# EAGLE design untitled (EAGLE 5.07)
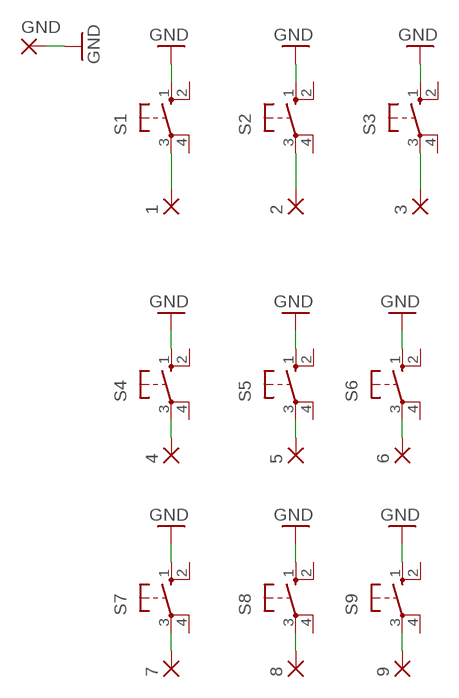
[diagram p0: schematic, sheet 1]

## Parts
1  2,15/1,0  [2,15/1,0]
2  2,15/1,0  [2,15/1,0]
3  2,15/1,0  [2,15/1,0]
4  2,15/1,0  [2,15/1,0]
5  2,15/1,0  [2,15/1,0]
6  2,15/1,0  [2,15/1,0]
7  2,15/1,0  [2,15/1,0]
8  2,15/1,0  [2,15/1,0]
9  2,15/1,0  [2,15/1,0]
GND  2,15/1,0  [2,15/1,0]
S1  10-XX  [B3F-10XX]
S2  10-XX  [B3F-10XX]
S3  10-XX  [B3F-10XX]
S4  10-XX  [B3F-10XX]
S5  10-XX  [B3F-10XX]
S6  10-XX  [B3F-10XX]
S7  10-XX  [B3F-10XX]
S8  10-XX  [B3F-10XX]
S9  10-XX  [B3F-10XX]

## Nets
GND: GND.1(P) S1.1(S) S2.1(S) S3.1(S) S4.1(S) S5.1(S) S6.1(S) S7.1(S) S8.1(S) S9.1(S)
N$1: 4.1(P) S4.3(P)
N$2: 5.1(P) S5.3(P)
N$3: 1.1(P) S1.3(P)
N$4: 2.1(P) S2.3(P)
N$5: 3.1(P) S3.3(P)
N$6: 6.1(P) S6.3(P)
N$7: 7.1(P) S7.3(P)
N$8: 8.1(P) S8.3(P)
N$9: 9.1(P) S9.3(P)
Unconnected: S1.2(S1) S1.4(P1) S2.2(S1) S2.4(P1) S3.2(S1) S3.4(P1) S4.2(S1) S4.4(P1) S5.2(S1) S5.4(P1) S6.2(S1) S6.4(P1) S7.2(S1) S7.4(P1) S8.2(S1) S8.4(P1) S9.2(S1) S9.4(P1)

## Library data of the parts
1-9 GND = wirepad:2,15/1,0: THROUGH-HOLE PAD
S1-S9 = switch-omron:10-XX: OMRON SWITCH

## Board
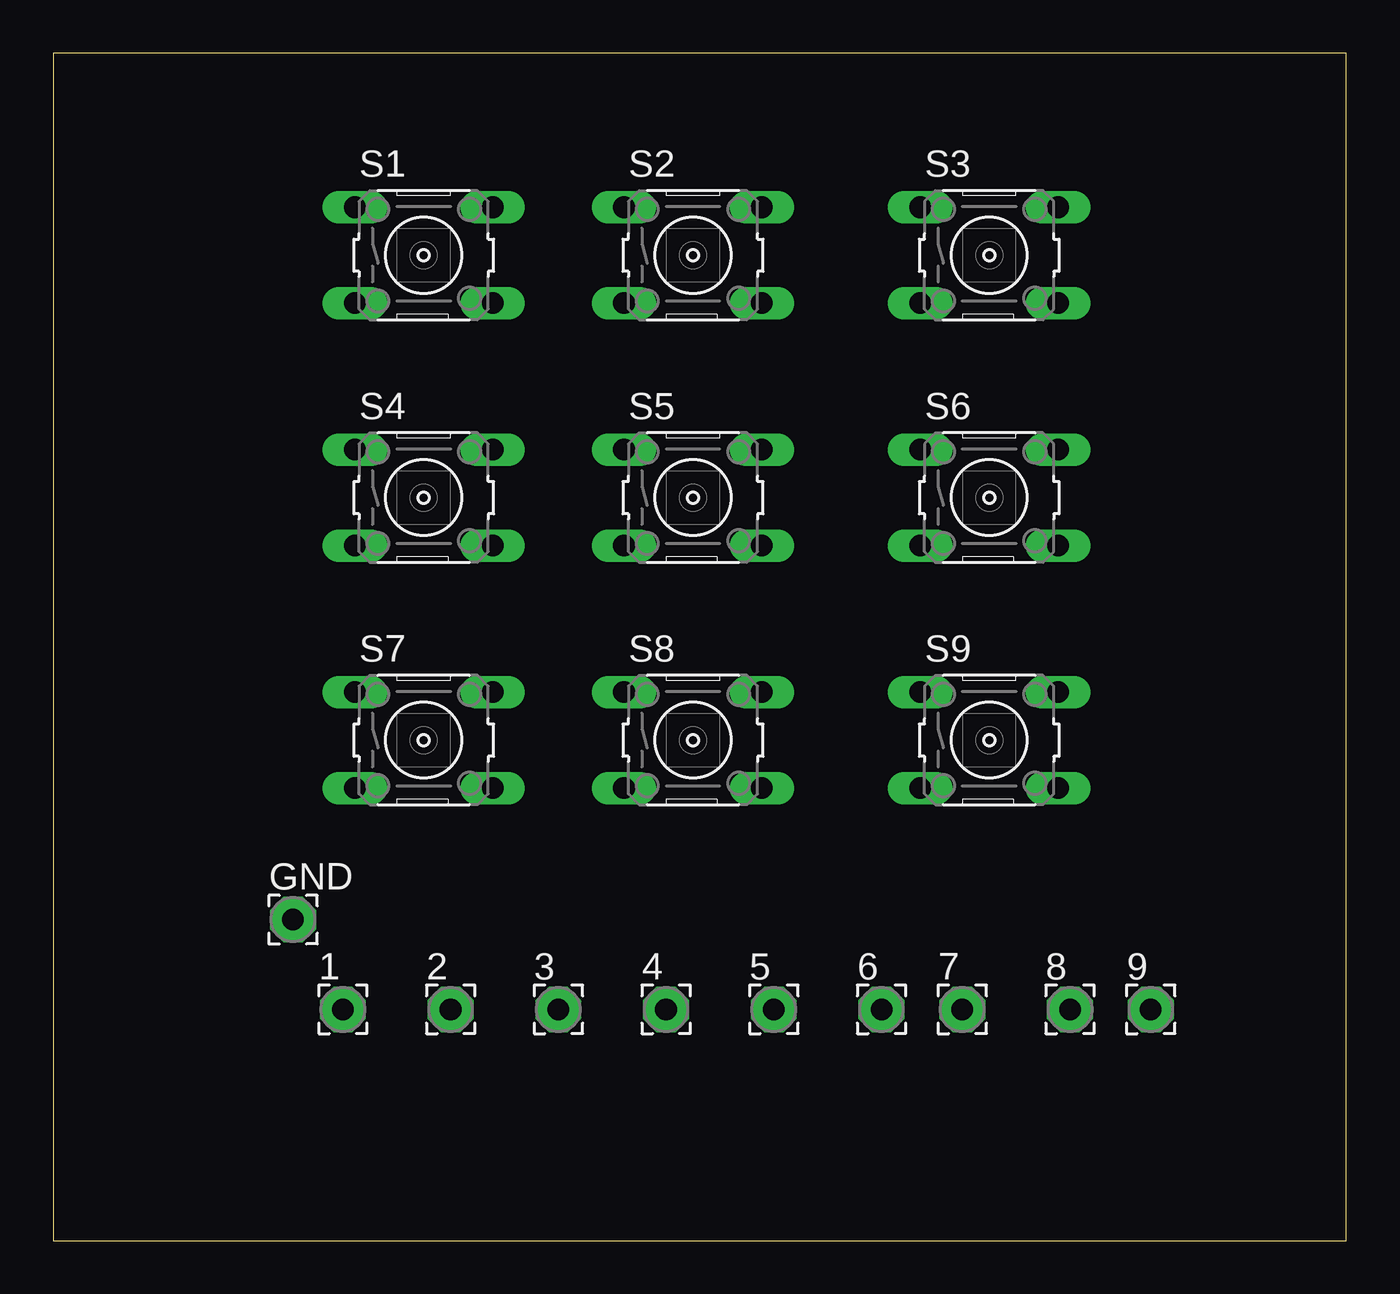
[diagram p1: board, top side]
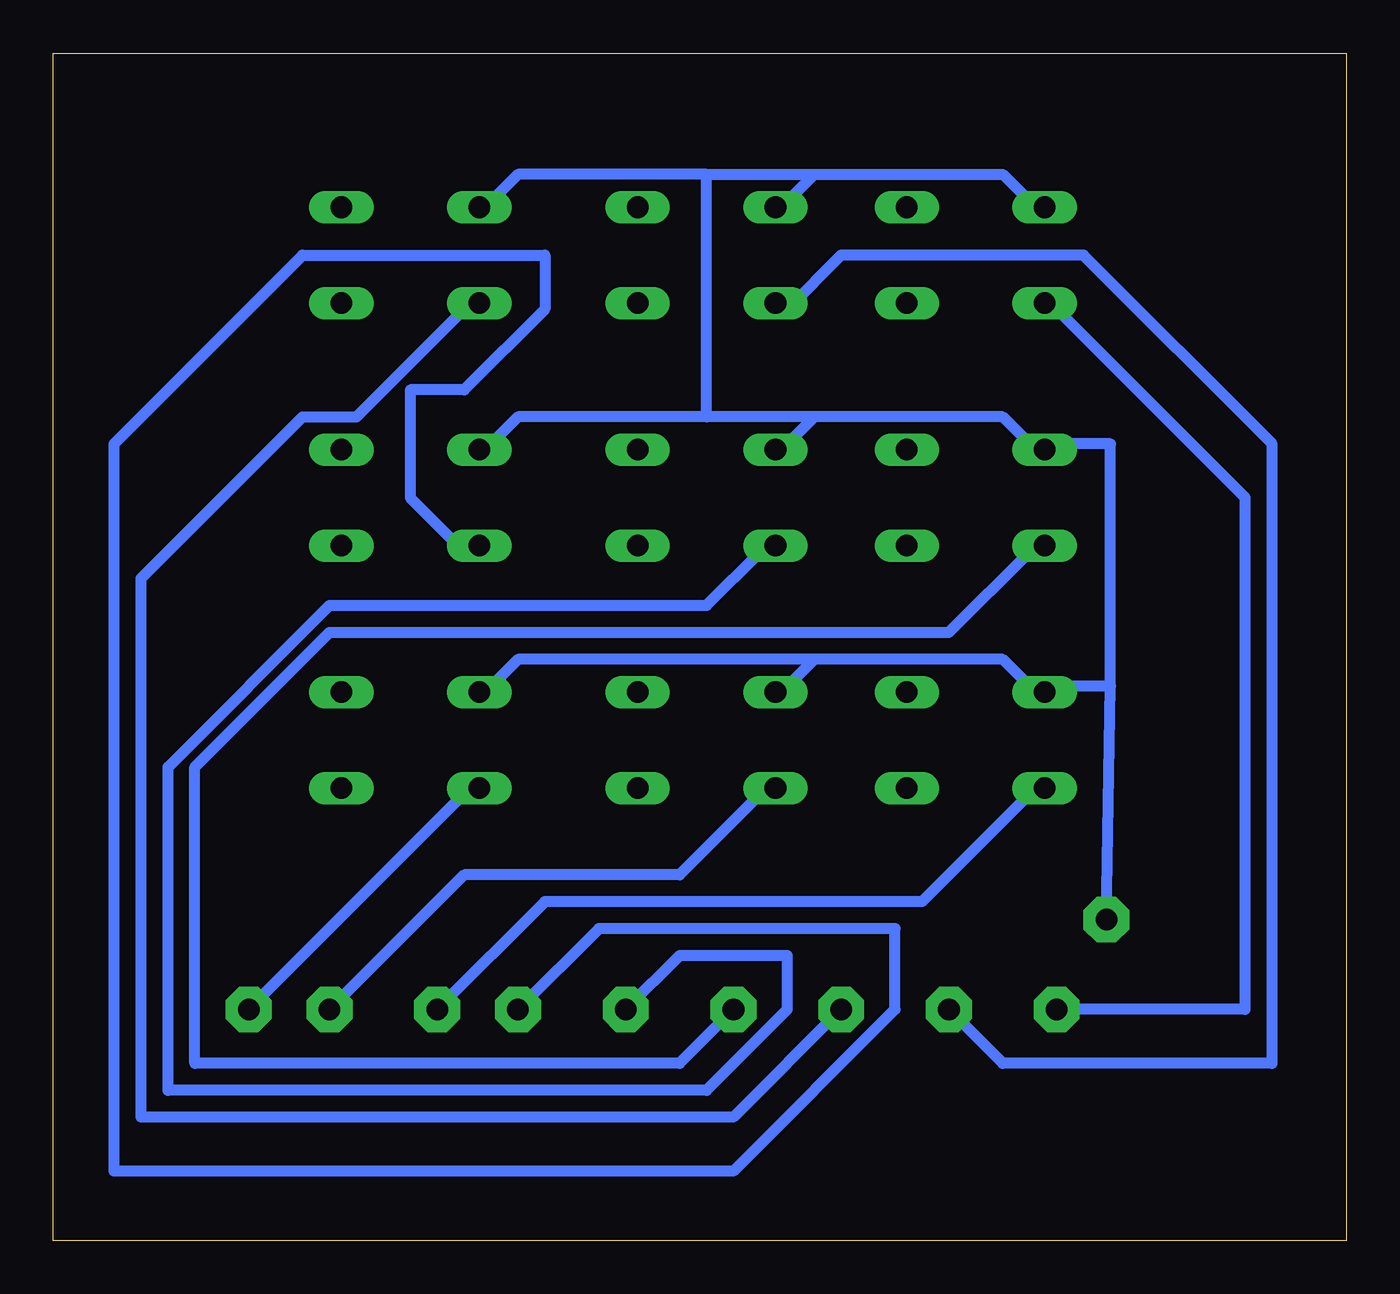
[diagram p2: board, bottom side, seen from below]

Size 61 x 56 mm. Coordinates in mm from the lower left corner, seen from the top.
Outline: 0,0 61,0 61,56 0,56 0,0
Copper layers (1*16): Top 0.035mm / dielectric 1.5mm / Bottom 0.035mm
Design rules "default *": minimum track width 20mil, minimum drill 24mil, track to track 8mil, track to pad 8mil, pad to pad 8mil, via to via 8mil, smd to smd 8mil, copper to edge 40mil, drill to drill 8mil, minimum pad ring 10mil, minimum via ring 8mil, stop-mask expansion 4mil, vias tented up to drill 0mil, thermal gap 10mil

### Footprints (pad centres in the part's own frame; a part is rotated, then mirrored left to right if it is on the bottom)
2,15/1,0 = drill 1.016 pad 2.159 octagon: 1 0,0
B3F-10XX = drill 1.016 long: 1 -3.251,2.261; 2 3.251,2.261; 3 -3.251,-2.261; 4 3.251,-2.261

### Placement (x,y rotation side)
1  13.67,10.91 0 top
2  18.75,10.91 0 top
3  23.83,10.91 0 top
4  28.91,10.91 0 top
5  33.99,10.91 0 top
6  39.07,10.91 0 top
7  42.88,10.91 0 top
8  47.96,10.91 0 top
9  51.77,10.91 0 top
GND  11.32,15.15 0 top
S1  17.48,46.47 0 top
S2  30.18,46.47 0 top
S3  44.15,46.47 0 top
S4  17.48,35.04 0 top
S5  30.18,35.04 0 top
S6  44.15,35.04 0 top
S7  17.48,23.61 0 top
S8  30.18,23.61 0 top
S9  44.15,23.61 0 top

### Tracks (layer width: path | path; a pad name or v marks a point on that pad's centre or on a via)
GND
  Bottom 0.508: GND.1 11.13,26.15 | 11.13,26.15 13.67,26.15 S7.1 14.94,26.15 16.21,27.42 25.1,27.42 | 25.1,27.42 26.37,26.15 S8.1 | 25.1,27.42 39.07,27.42 40.34,26.15 S9.1 | 25.1,38.85 16.21,38.85 14.94,37.58 S4.1 13.67,37.58 11.13,37.58 11.13,26.15 | 25.1,38.85 26.37,37.58 S5.1 | 25.1,38.85 30.18,38.85 | 30.18,38.85 39.07,38.85 40.34,37.58 S6.1 | 25.1,50.28 16.21,50.28 14.94,49.01 S1.1 | 25.1,50.28 26.37,49.01 S2.1 | 30.18,50.28 25.1,50.28 | 30.18,50.28 39.07,50.28 40.34,49.01 S3.1 | 30.18,38.85 30.18,50.28
N$1
  Bottom 0.508: 4.1 31.45,8.37 54.31,8.37 54.31,22.34 47.96,28.69 18.75,28.69 14.94,32.5 S4.3
N$2
  Bottom 0.508: 5.1 31.45,13.45 26.37,13.45 26.37,10.91 30.18,7.1 55.58,7.1 55.58,22.34 47.96,29.96 30.18,29.96 27.64,32.5 S5.3
N$3
  Bottom 0.508: 1.1 4.78,10.91 4.78,35.04 13.67,43.93 S1.3
N$4
  Bottom 0.508: 2.1 16.21,8.37 3.51,8.37 3.51,37.58 12.4,46.47 23.83,46.47 26.37,43.93 S2.3
N$5
  Bottom 0.508: 3.1 28.91,5.83 56.85,5.83 56.85,31.23 49.23,38.85 46.69,38.85 41.61,43.93 S3.3
N$6
  Bottom 0.508: 6.1 35.26,14.72 21.29,14.72 21.29,10.91 28.91,3.29 58.12,3.29 58.12,37.58 49.23,46.47 37.8,46.47 37.8,43.93 41.61,40.12 44.15,40.12 44.15,35.04 41.61,32.5 S6.3
N$7
  Bottom 0.508: 7.1 37.8,15.99 20.02,15.99 14.94,21.07 S7.3
N$8
  Bottom 0.508: 8.1 41.61,17.26 31.45,17.26 27.64,21.07 S8.3
N$9
  Bottom 0.508: 9.1 41.61,21.07 S9.3